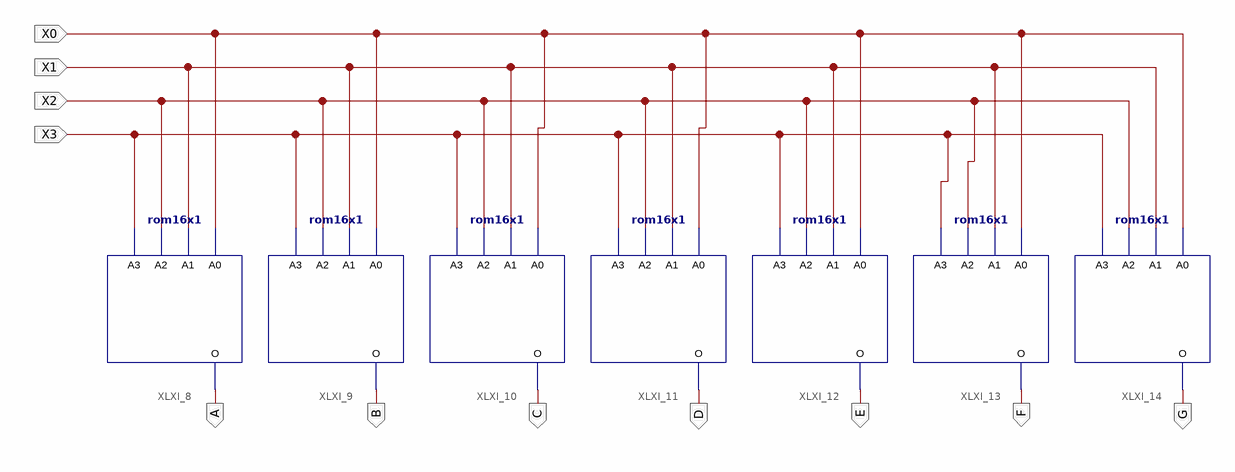
[diagram p0: schematic sheet 1]
// Xilinx ISE schematic LUT.sch (spartan3e) as structural Verilog: 7 symbols, 11 ports
module LUT (
  input  X0,
  input  X1,
  input  X2,
  input  X3,
  output A,
  output B,
  output C,
  output D,
  output E,
  output F,
  output G
);

  rom16x1 #(.INIT("2812")) XLXI_8 (.A0(X0), .A1(X1), .A2(X2), .A3(X3), .O(A));
  rom16x1 #(.INIT("D860")) XLXI_9 (.A0(X0), .A1(X1), .A2(X2), .A3(X3), .O(B));
  rom16x1 #(.INIT("D004")) XLXI_10 (.A0(X0), .A1(X1), .A2(X2), .A3(X3), .O(C));
  rom16x1 #(.INIT("8492")) XLXI_11 (.A0(X0), .A1(X1), .A2(X2), .A3(X3), .O(D));
  rom16x1 #(.INIT("02BA")) XLXI_12 (.A0(X0), .A1(X1), .A2(X2), .A3(X3), .O(E));
  rom16x1 #(.INIT("208E")) XLXI_13 (.A0(X0), .A1(X1), .A2(X2), .A3(X3), .O(F));
  rom16x1 #(.INIT("1083")) XLXI_14 (.A0(X0), .A1(X1), .A2(X2), .A3(X3), .O(G));
endmodule
